# Altium schematic sheet cpu.SchDoc
size A3; Organization: Develer s.r.l.; Address1: via Mugellese 1/A; Address2: 50019 Campi Bisenzio; Address3: Firenze; Address4: ITALY; Revision: A; SheetNumber: 1; SheetTotal: 1
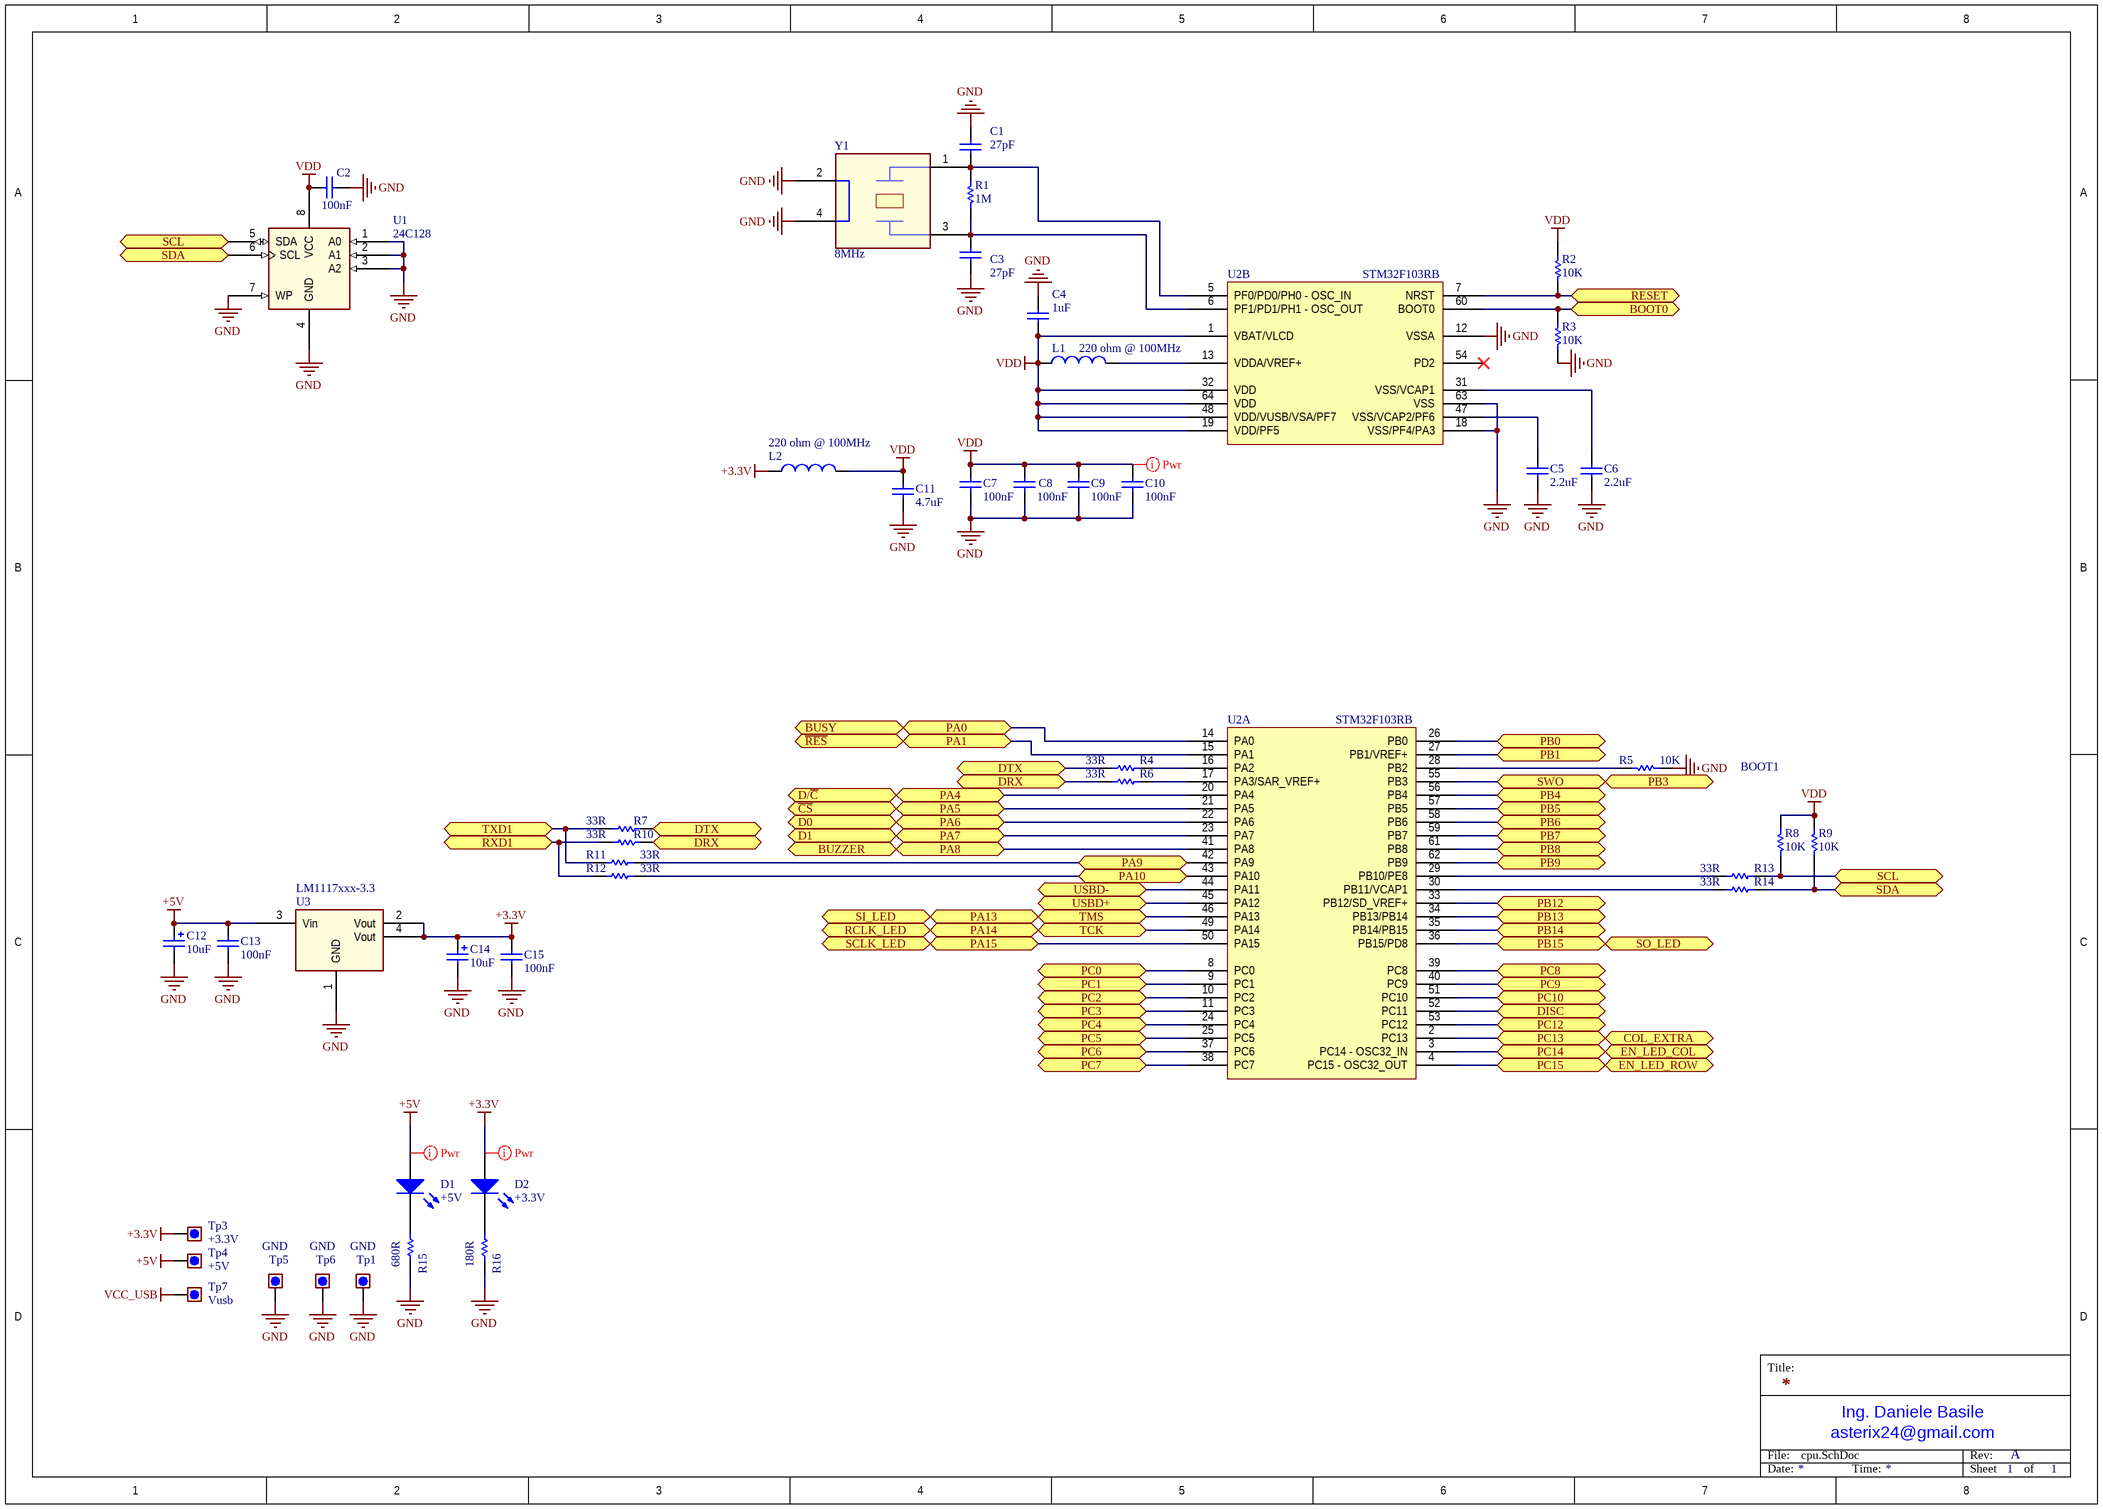
[diagram p0: cpu.SchDoc]

## Parts
C1  27pF  [0603_[1608]]
C2  100nF  [0603_[1608]]
C3  27pF  [0603_[1608]]
C4  1uF  [0603_[1608]]
C5  2.2uF  [0603_[1608]]
C6  2.2uF  [0603_[1608]]
C7  100nF  [0603_[1608]]
C8  100nF  [0603_[1608]]
C9  100nF  [0603_[1608]]
C10  100nF  [0603_[1608]]
C11  4.7uF  [0603_[1608]]
C12  10uF  [1206_[3216]]
C13  100nF  [0603_[1608]]
C14  10uF  [1206_[3216]]
C15  100nF  [0603_[1608]]
D1  +5V  [0603_[1608]_K2-A1_LED]
D2  +3.3V  [0603_[1608]_K2-A1_LED]
L1  220 ohm @ 100MHz  [0805_[2012]]
L2  220 ohm @ 100MHz  [0805_[2012]]
R1  1M  [0603_[1608]]
R2  10K  [0603_[1608]]
R3  10K  [0603_[1608]]
R4  33R  [0603_[1608]]
R5  10K  [0603_[1608]]
R6  33R  [0603_[1608]]
R7  33R  [0603_[1608]]
R8  10K  [0603_[1608]]
R9  10K  [0603_[1608]]
R10  33R  [0603_[1608]]
R11  33R  [0603_[1608]]
R12  33R  [0603_[1608]]
R13  33R  [0603_[1608]]
R14  33R  [0603_[1608]]
R15  680R  [0603_[1608]]
R16  180R  [0603_[1608]]
Tp1  GND  [TEST_POINT_THD_D1.8MM]  (no BOM)
Tp3  +3.3V  [TEST_POINT_THD_D1.8MM]  (no BOM)
Tp4  +5V  [TEST_POINT_THD_D1.8MM]  (no BOM)
Tp5  GND  [TEST_POINT_THD_D1.8MM]  (no BOM)
Tp6  GND  [TEST_POINT_THD_D1.8MM]  (no BOM)
Tp7  Vusb  [TEST_POINT_THD_D1.8MM]  (no BOM)
U1  24C128  [SOIC8]
U2  STM32F103RB  [TSQFP50P1200X1200X160-64N]  (parts A,B of 2)
U3  LM1117xxx-3.3  [SOT-223]
Y1  8MHz  [CRYSTAL_3.2X2.5MM_4P_SMD]

## Ports
BOOT0, BUSY, BUZZER, COL_EXTRA, D0, D1, D/~{C}, DISC, DRX, DTX, EN_LED_COL, EN_LED_ROW, PA0, PA1, PA4, PA5, PA6, PA7, PA8, PA9, PA10, PA13, PA14, PA15, PB0, PB1, PB3, PB4, PB5, PB6, PB7, PB8, PB9, PB12, PB13, PB14, PB15, PC0, PC1, PC2, PC3, PC4, PC5, PC6, PC7, PC8, PC9, PC10, PC12, PC13, PC14, PC15, RCLK_LED, RESET, RXD1, SCL, SCLK_LED, SDA, SI_LED, SO_LED, SWO, TCK, TMS, TXD1, USBD+, USBD-, ~{CS}, ~{RES}

## Nets
+3.3V: C14.1 C15.2 D2.1(A) L2.1 Tp3.1 U3.2(Vout) U3.4(Vout)
+5V: C12.1 C13.2 D1.1(A) Tp4.1 U3.3(Vin)
GND: C1.2 C2.1 C3.2 C4.2 C5.1 C6.1 C7.2 C8.2 C9.2 C10.2 C11.1 C12.2 C13.1 C14.2 C15.1 R3.1 R5.2 R15.1 R16.1 Tp1.1 Tp5.1 Tp6.1 U1.1(A0) U1.2(A1) U1.3(A2) U1.4(GND) U1.7(WP) U2.12(VSSA) U2.18(VSS/PF4/PA3) U2.63(VSS) U3.1(GND) Y1.2 Y1.4
VCC_USB: Tp7.1
VDD: C2.2 C4.1 C7.1 C8.1 C9.1 C10.1 C11.2 L1.1 L2.2 R2.1 R8.2 R9.2 U1.8(VCC) U2.1(VBAT/VLCD) U2.19(VDD/PF5) U2.32(VDD) U2.48(VDD/VUSB/VSA/PF7) U2.64(VDD)
BOOT0: R3.2 U2.60(BOOT0) ; port BOOT0
BUSY: U2.14(PA0) ; port PA0, port BUSY
BUZZER: U2.41(PA8) ; port PA8, port BUZZER
~{CS}: U2.21(PA5) ; port PA5, port ~{CS}
COL_EXTRA: U2.2(PC13) ; port PC13, port COL_EXTRA
D0: U2.22(PA6) ; port PA6, port D0
D1: U2.23(PA7) ; port PA7, port D1
D/~{C}: U2.20(PA4) ; port PA4, port D/~{C}
DISC: U2.52(PC11) ; port DISC
DRX: R6.2 R10.1 ; port DRX
DTX: R4.2 R7.1 ; port DTX
EN_LED_COL: U2.3(PC14_-_OSC32_IN) ; port PC14, port EN_LED_COL
EN_LED_ROW: U2.4(PC15_-_OSC32_OUT) ; port PC15, port EN_LED_ROW
PA1: U2.15(PA1) ; port PA1, port ~{RES}
PA9: R11.1 U2.42(PA9) ; port PA9
PA10: R12.1 U2.43(PA10) ; port PA10
PA13: U2.46(PA13) ; port TMS, port PA13, port SI_LED
PA14: U2.49(PA14) ; port TCK, port PA14, port RCLK_LED
PA15: U2.50(PA15) ; port PA15, port SCLK_LED
PB0: U2.26(PB0) ; port PB0
PB1: U2.27(PB1/VREF+) ; port PB1
PB3: U2.55(PB3) ; port SWO, port PB3
PB4: U2.56(PB4) ; port PB4
PB5: U2.57(PB5) ; port PB5
PB6: U2.58(PB6) ; port PB6
PB7: U2.59(PB7) ; port PB7
PB8: U2.61(PB8) ; port PB8
PB9: U2.62(PB9) ; port PB9
PB12: U2.33(PB12/SD_VREF+) ; port PB12
PB13: U2.34(PB13/PB14) ; port PB13
PB14: U2.35(PB14/PB15) ; port PB14
PB15: U2.36(PB15/PD8) ; port PB15, port SO_LED
PC0: U2.8(PC0) ; port PC0
PC1: U2.9(PC1) ; port PC1
PC2: U2.10(PC2) ; port PC2
PC3: U2.11(PC3) ; port PC3
PC4: U2.24(PC4) ; port PC4
PC5: U2.25(PC5) ; port PC5
PC6: U2.37(PC6) ; port PC6
PC7: U2.38(PC7) ; port PC7
PC8: U2.39(PC8) ; port PC8
PC9: U2.40(PC9) ; port PC9
PC10: U2.51(PC10) ; port PC10
PC12: U2.53(PC12) ; port PC12
RESET: R2.2 U2.7(NRST) ; port RESET
RXD1: R10.2 R12.2 ; port RXD1
SCL: R8.1 R13.1 U1.5(SDA) ; port SCL
SDA: R9.1 R14.1 U1.6(SCL) ; port SDA
TXD1: R7.2 R11.2 ; port TXD1
USBD+: U2.45(PA12) ; port USBD+
USBD-: U2.44(PA11) ; port USBD-
NetC1_1: C1.1 R1.2 U2.5(PF0/PD0/PH0_-_OSC_IN) Y1.1
NetC3_1: C3.1 R1.1 U2.6(PF1/PD1/PH1_-_OSC_OUT) Y1.3
NetC5_2: C5.2 U2.47(VSS/VCAP2/PF6)
NetC6_2: C6.2 U2.31(VSS/VCAP1)
NetD1_2: D1.2(K) R15.2
NetD2_2: D2.2(K) R16.2
NetL1_2: L1.2 U2.13(VDDA/VREF+)
NetR4_1: R4.1 U2.16(PA2)
NetR5_1: R5.1 U2.28(PB2)
NetR6_1: R6.1 U2.17(PA3/SAR_VREF+)
NetR13_2: R13.2 U2.29(PB10/PE8)
NetR14_2: R14.2 U2.30(PB11/VCAP1)

Not connected (* = marked no-connect by the designer): U2 54(PD2)*

## Layout directives
net class Power: +3.3V, +5V, VDD

## Notes on the sheet
- BOOT1
- Title:
- File:
- asterix24@gmail.com
- Ing. Daniele Basile
- Rev:
- Date:
- Time:
- Sheet
- of

## Library data of the parts
C1 C3 = Cap: Ceramic NP0 +/- 0.1; Value: 10nF; Published: 8-Jun-2000; Revision: July-2002: Re-released for DXP Platform.; Publisher: Altium Limited
C2 C7-C10 = Cap: Ceramic X7R 50V; Value: 10nF; Published: 8-Jun-2000; Revision: July-2002: Re-released for DXP Platform.; Publisher: Altium Limited
C4 C11 = Cap: Ceramic X7R 16V; Value: 10nF; Published: 8-Jun-2000; Revision: July-2002: Re-released for DXP Platform.; Publisher: Altium Limited
C5 C6 = Cap: Ceramic 6.3V X7R; Value: 10nF; Published: 8-Jun-2000; Revision: July-2002: Re-released for DXP Platform.; Publisher: Altium Limited
C12 C14 = Cap Pol1: Ceramic X5R 25V; Published: 8-Jun-2000; Revision: July-2002: Re-released for DXP Platform.; Publisher: Altium Limited; Value: 10uF
C13 C15 = Cap: Ceramic X7R 50V; Value: 100pF; Published: 8-Jun-2000; LatestRevisionDate: 17-Jul-2002; LatestRevisionNote: Re-released for DXP Platform.; PackageReference: RAD-0.3; Publisher: Altium Limited; PackageDescription: Radial Cap, Thru-Hole; 2 Leads; 0.3 in Pin Spacing
D1 D2 = LED0: LED Green; Published: 8-Jun-2000; LatestRevisionDate: 08-Jul-2005; LatestRevisionNote: Mech Layer 1 removed.; PackageReference: LED-0; Publisher: Altium Limited; PackageDescription: LED; 2 Leads
L1 = Inductor: Value: 100uH; Published: 8-Jun-2000; Revision: July-2002: Re-released for DXP Platform.; Publisher: Altium Limited
L2 = Inductor: WE 742792022
R1-R14 = Res1: Resistor; Value: 1K; Published: 8-Jun-2000; Revision: July-2002: Re-released for DXP Platform.; Publisher: Altium Limited
R15 R16 = Res1: Resistor; Revision: July-2002: Re-released for DXP Platform.
Tp1 Tp3-Tp7 = Test_point: Test point
U1 = EEPROM-SOIC8: EEPROM
U3 = LM1117-FIXED-OUT: LM1117 LDO Fixed output
Y1 = CRYSTAL-4p